# Altium project Arduino nano.PrjPcb
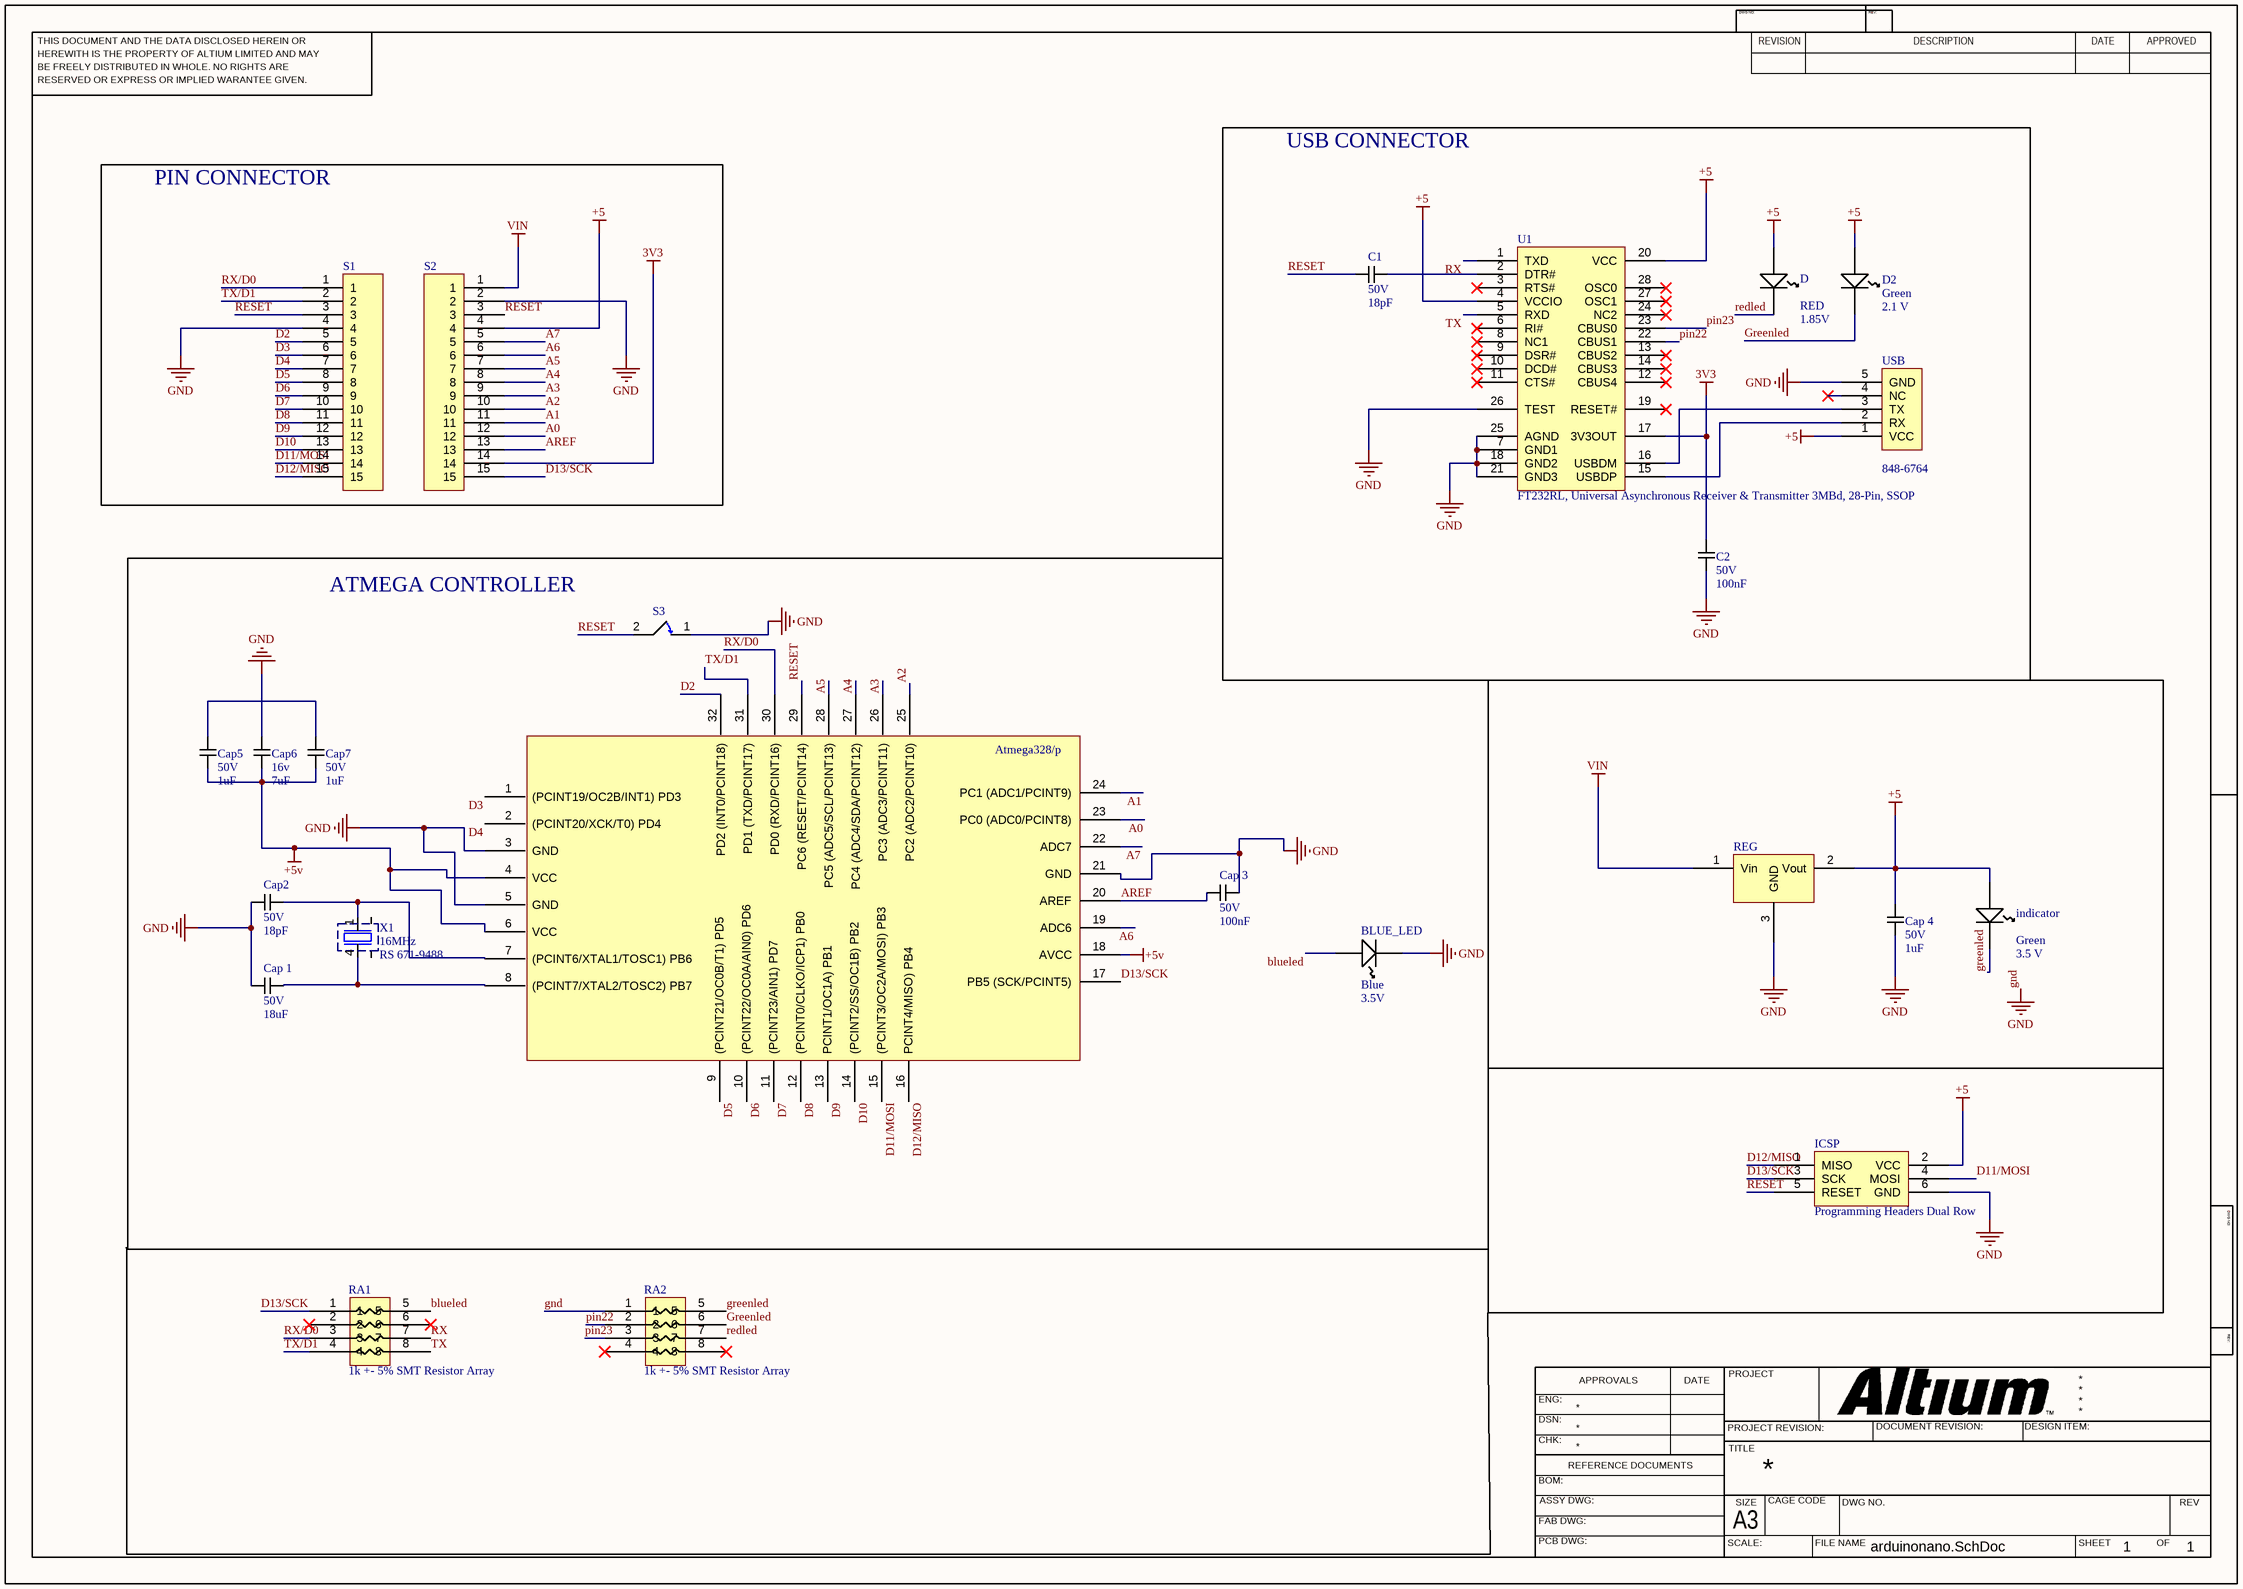
[diagram p0: arduinonano.SchDoc]
1 sheet, 24 parts. Net scope: global (net labels, ports and power ports of the same name join across sheets).
Board file: ardunionano.PcbDoc

## Sheet arduinonano.SchDoc
size 420 x 297 mm; SheetNumber: 1; SheetTotal: 1

### Parts
BLUE_LED  Color: Blue  Forward Voltage: 3.5V  [LED1913X12NBLUE]  (hidden comment: Kingbright Blue LED, 60 mcd 120 ° 0805)
C1  Voltage: 50V  Capacitance: 18pF  [CAPCP2012X09N]  (hidden comment: C0805C180J5GACTU)
C2  Voltage: 50V  Capacitance: 100nF  [CAPCP2012X09N]  (hidden comment: C0805C180J5GACTU)
Cap2  Voltage: 50V  Capacitance: 18pF  [CAPCP2012X09N]  (hidden comment: C0805C180J5GACTU)
Cap5  Voltage: 50V  Capacitance: 1uF  [CAPCP2012X09N]  (hidden comment: C0805C180J5GACTU)
Cap6  Voltage: 16v  Capacitance: 7uF  [CAPCP2012X09N]  (hidden comment: C0805C180J5GACTU)
Cap7  Voltage: 50V  Capacitance: 1uF  [CAPCP2012X09N]  (hidden comment: C0805C180J5GACTU)
Cap_1  Voltage: 50V  Capacitance: 18uF  [CAPCP2012X09N]  (hidden comment: C0805C180J5GACTU)
Cap_3  Voltage: 50V  Capacitance: 100nF  [CAPCP2012X09N]  (hidden comment: 100nF Ceramic Multilayer Capacitor_1)
Cap_4  Voltage: 50V  Capacitance: 1uF  [CAPCP2012X09N]  (hidden comment: 100nF Ceramic Multilayer Capacitor_1)
D  Color: RED  Forward Voltage: 1.85V  [LED1913X12NRED]  (hidden comment: Kingbright Red LED, 100 mcd 120 ° 0805)
D2  Color: Green  Forward Voltage: 2.1 V  [LED1913X12NGREEN]  (hidden comment: Kingbright Green LED, 70 mcd 120 ° 0805)
ICSP  Programming Headers Dual Row  [ISP HEADER]
indicator  Color: Green  Forward Voltage: 3.5 V  [LED1913X12NGREEN]  (hidden comment: Kingbright Green LED, 70 mcd 120 ° 0805)
nano  Atmega328/p  [TQFP80P900X900X120-32N]
RA1  1k +- 5% SMT Resistor Array  [1206 RA]
RA2  1k +- 5% SMT Resistor Array  [1206 RA]
REG  LM1117MP-5.0/NOPB, Low Dropout Voltage Regulator, 1.5A, 5 V ±1%, 4-Pin SOT-223  [SOT230P700X180-4N]  (value not drawn)
S1  connector;str header;single row;.1 cont centers;.095 tail;gold or gtx;36 contact  [Header]  (value not drawn)
S2  connector;str header;single row;.1 cont centers;.095 tail;gold or gtx;36 contact  [Header]  (value not drawn)
S3  Button Tactile Switch, NO 0.05 A 0.8mm  [Button8014X17N]  (value not drawn)
U1  FT232RL, Universal Asynchronous Receiver & Transmitter 3MBd, 28-Pin, SSOP  [SOP65P780X200-28N]
USB  RS Stock No: 848-6764  [MicroUSB]  (hidden comment: NewMolex Right Angle SMT Female Type B Micro USB Connector, 30 V ac, 1.8A)
X1  value 16MHz  RS: RS 671-9488  [Aker S5C Crystal]  (hidden comment: Aker 16MHz Crystal SMT)

### Blocks framed on the sheet
USB CONNECTOR: C1 C2 D D2 U1 USB
PIN CONNECTOR: S1 S2

### Nets
3V3: C2.1 S2.14 U1.17(3V3OUT)
+5: Cap_4.2 D.1(A) D2.1(A) ICSP.2(VCC) indicator.1(A) REG.2(Vout) S2.4 U1.4(VCCIO) U1.20(VCC) USB.1(VCC)
+5v: Cap5.2 Cap6.2 Cap7.2 nano.4(VCC) nano.6(VCC) nano.18(AVCC)
gnd: BLUE_LED.2(K) C2.2 Cap2.1 Cap6.1 Cap_1.1 Cap_3.2 Cap_4.1 ICSP.6(GND) nano.3(GND) nano.5(GND) nano.21(GND) RA2.1 REG.3(GND) S1.4 S2.2 S3.1 U1.7(GND1) U1.18(GND2) U1.21(GND3) U1.25(AGND) U1.26(TEST) USB.5(GND)
VIN: REG.1(Vin) S2.1
A0: nano.23(PC0_(ADC0/PCINT8)) S2.12
A1: nano.24(PC1_(ADC1/PCINT9)) S2.11
A2: nano.25(PC2_(ADC2/PCINT10)) S2.10
A3: nano.26(PC3_(ADC3/PCINT11)) S2.9
A4: nano.27(PC4_(ADC4/SDA/PCINT12)) S2.8
A5: nano.28(PC5_(ADC5/SCL/PCINT13)) S2.7
A6: nano.19(ADC6) S2.6
A7: nano.22(ADC7) S2.5
AREF: Cap_3.1 nano.20(AREF) S2.13
blueled: BLUE_LED.1(A) RA1.5
D2: nano.32(PD2_(INT0/PCINT18)) S1.5
D3: nano.1((PCINT19/OC2B/INT1)_PD3) S1.6
D4: nano.2((PCINT20/XCK/T0)_PD4) S1.7
D5: nano.9((PCINT21/OC0B/T1)_PD5) S1.8
D6: nano.10((PCINT22/OC0A/AIN0)_PD6) S1.9
D7: nano.11((PCINT23/AIN1)_PD7) S1.10
D8: nano.12((PCINT0/CLKO/ICP1)_PB0) S1.11
D9: nano.13(PCINT1/OC1A)_PB1) S1.12
D10: nano.14((PCINT2/SS/OC1B)_PB2) S1.13
D11/MOSI: ICSP.4(MOSI) nano.15((PCINT3/OC2A/MOSI)_PB3) S1.14
D12/MISO: ICSP.1(MISO) nano.16(PCINT4/MISO)_PB4) S1.15
D13/SCK: ICSP.3(SCK) nano.17(PB5_(SCK/PCINT5)) RA1.1 S2.15
Greenled: D2.2(K) indicator.2(K) RA2.5 RA2.6
pin22: RA2.2 U1.22(CBUS1)
pin23: RA2.3 U1.23(CBUS0)
redled: D.2(K) RA2.7
RESET: C1.2 ICSP.5(RESET) nano.29(PC6_(RESET/PCINT14)) S1.3 S2.3 S3.2
RX: RA1.7 U1.1(TXD)
RX/D0: nano.30(PD0_(RXD/PCINT16)) RA1.3 S1.1
TX: RA1.8 U1.5(RXD)
TX/D1: nano.31(PD1_(TXD/PCINT17)) RA1.4 S1.2
NetC1_1: C1.1 U1.2(DTR#)
NetCap2_2: Cap2.2 nano.7((PCINT6/XTAL1/TOSC1)_PB6) X1.1
NetCap5_1: Cap5.1 Cap7.1
NetCap_1_2: Cap_1.2 nano.8((PCINT7/XTAL2/TOSC2)_PB7) X1.4
NetU1_15: U1.15(USBDP) USB.2(RX)
NetU1_16: U1.16(USBDM) USB.3(TX)

Not connected (* = marked no-connect by the designer): RA1 2* 6*; RA2 4* 8*; U1 3(RTS#)* 6(RI#)* 8(NC1)* 9(DSR#)* 10(DCD#)* 11(CTS#)* 12(CBUS4)* 13(CBUS2)* 14(CBUS3)* 19(RESET#)* 24(NC2)* 27(OSC1)* 28(OSC0)*; USB 4(NC)*; X1 2(Gnd) 3(Gnd)

### Notes on the sheet
- ATMEGA CONTROLLER
- THIS DOCUMENT AND THE DATA DISCLOSED HEREIN OR
- HEREWITH IS THE PROPERTY OF ALTIUM LIMITED AND MAY
- DWG NO:
- REVISION
- REV:
- DESCRIPTION
- DATE
- APPROVED
- BE FREELY DISTRIBUTED IN WHOLE. NO RIGHTS ARE
- RESERVED OR EXPRESS OR IMPLIED WARANTEE GIVEN.
- ENG:
- APPROVALS
- PROJECT
- DSN:
- CHK:
- REFERENCE DOCUMENTS
- PROJECT REVISION:
- TITLE
- DOCUMENT REVISION:
- DESIGN ITEM:
- BOM:
- FAB DWG:
- PCB DWG:
- ASSY DWG:
- SCALE:
- A3
- SIZE
- CAGE CODE
- FILE NAME
- DWG NO.
- SHEET
- OF
- REV

### Library data of the parts
BLUE_LED = Kingbright Blue LED, 60 mcd 120 ° 0805: Manufacturer Part No.: KP-2012PBC-A; Creator: Ritesh Kanjee; Date Created: 18 February 2015; Manufacturer: KingBright; RS Stock No.: 466-3784; Datasheet URL: http://za.rs-online.com/web/p/visible-leds/4663784/
C1 C2 Cap2 Cap5-Cap7 Cap_1 = 18pF Ceramic Multilayer Capacitor, 50 V dc C0G Dielectric ±5% SMD: Manufacturer: Kemet; Creator: Ritesh Kanjee; Date Created: 18 February 2015; Package: 0805; RS Stock No.: 648-0935; Datasheet URL: http://za.rs-online.com/web/p/ceramic-multilayer-capacitors/6480935/?searchTerm=C0805C180J5GACTU&relevancy-data=636F3D3226696E3D4931384E4B6E6F776E41734D504E266C753D656E266D6D3D6D61746368616C6C7061727469616C26706D3D5E5B5C707B4C7D5C707B4E647D2D2C2F255C2E5D2B2426706F3D313326736E3D592673743D4D414E5F504152545F4E554D4245522677633D424F5448267573743D4330383035433138304A35474143545526
Cap_3 Cap_4 = 100nF Ceramic Multilayer Capacitor_1: AVX 0805 Standard 100nF Ceramic Multilayer Capacitor, 50 V dc X7R Dielectric ±10% SMD; Creator: Ritesh Kanjee; Date Created: 18 February 2015; Package: 0805; Manufacturer: AVX; RS Stock No.: 464-6688; Datasheet URL: http://za.rs-online.com/web/p/ceramic-multilayer-capacitors/4646688/
D = Kingbright Red LED, 100 mcd 120 ° 0805: Manufacturer Part No.: KP-2012SRC-PRV; Creator: Ritesh Kanjee; Date Created: 18 February 2015; Manufacturer: KingBright; RS Stock No.: 466-3813; Datasheet URL: http://za.rs-online.com/web/p/visible-leds/4663813/
D2 indicator = Kingbright Green LED, 70 mcd 120 ° 0805: Manufacturer Part No.: KP-2012MGC; Creator: Ritesh Kanjee; Date Created: 18 February 2015; Manufacturer: KingBright; RS Stock No.: 466-3778; Datasheet URL: http://za.rs-online.com/web/p/visible-leds/4663778/
ICSP = Programming ISP, Programming Headers Dual Row: Manufacturer: FCI; Manufacturer Part No.: 68000-236HLF; Current Rating: 3Amps Continuous; Created By: R Kanjee; Date Created: 1 March 2015; RS Stock No.: 2509565626
nano = Atmega 328p: The Atmel® ATmega328P is a low-power CMOS 8-bit microcontroller based on the AVR® enhanced RISC architecture. By / executing powerful instructions in a single clock cycle, the ATmega328P achieves throughputs approaching 1MIPS per MHz / allowing the system designer to optimize power consumption versus processing speed.; ComponentLink1Description: New link; ComponentLink1URL: *; ComponentLink2Description: New link 1; ComponentLink2URL: *; ComponentLink3Description: New link 2; ComponentLink3URL: *; ComponentLink4Description: New link 3; ComponentLink4URL: *
RA1 RA2 = 1k +- 5% SMT Resistor Array: 1k +- 5% SMT Resistor Array 4 Res; Manufacturer: Bourns; Manufacturer Part No.: CAY16-102J4LF; Wattage: 0.25W; Creator: R Kanjee; RS Stock No.: 552-5579; Date Created: 25 February 2015
REG = LM1117MP-5.0: Manufacturer: Texas Instruments; Supply Current: 1.5Amps; Output Voltage: 5V; Maximum Input Voltage: 15V; Date Created: 26 February 2015; Created By: R Kanjee; RS Stock No.: 533-9583; Datasheet URL: http://za.rs-online.com/web/p/low-dropout-voltage-regulators/5339583/
S1 S2 = Single row; PCB headers: Manufacturer: FCI; Manufacturer Part No.: 68000-236HLF; Current Rating: 3Amps Continuous; Created By: R Kanjee; Date Created: 1 March 2015; RS Stock No.: 2509565626
S3 = Button Tactile Switch, NO 0.05 A 0.8mm: Manufacturer: C & K; Manufacturer Part No.: B3F1000; State: Normaly Open; Date Created: 25 February 2015; Creator: R Kanjee; RS Stock No.: 516-255
U1 = FT232RL USB to UART, Universal Asynchronous Receiver & Transmitter 3MBd, 28-Pin, SSOP: Manufacturer: FTDI Chip; Creator: R Kanjee; Date Created: 03 March 2015; Manufacturer Part No.: FT232RL; RS Stock No.: 406-580; Pin Count: 28
USB = Micro USB Connector, 30 V ac, 1.8A: Manufacturer: Molex; Manufacturer Part No.: 105017-0001; Max Voltage: 30V; Creator: R Kanjee; Date Created: 28 February 2015; Datasheet URL: http://za.rs-online.com/web/p/micro-usb-connectors/8486764/; Max Current: 1.8A
X1 = Aker  C5S-16.000-12-3030-X: Aker S5C SMT Crystal; Load Capacitance: 12pF; Frequency Stability: +/-30ppm; Creator: R Kanjee; Manufacturer: Aker; Manufacturer Part #: C5S-16.000-12-3030-X; Supplier: RS; RS Stock Nr.: 671-9488; HelpURL: http://za.rs-online.com/web/p/crystal-units/6719488/; Package: 3.2x5mm SMD